# Altium schematic sheet B2B_connectors.SchDoc: AFE Mezzanine
size 420 x 297 mm; Author: K.B.; CompanyName: WUT; DrawnBy: K.B.; Organization: WUT ISE; Address1: Warsaw Univeristy of Technology; Address2: Nowowiejska 15/19; DocumentNumber: 8; Revision: -; SheetNumber: 8; SheetTotal: 8; EDA_Number: ARTIQ; Projet: ARTIQ/SINARA; ModifiedBy: -; CreateDate: XX/XX/XXXX; CheckedDate: -; Title2: Connectors; DivGrp: ISE; Designer: K.B.; ModifiedDate: -; ProjectName: ARTIQ/SINARA
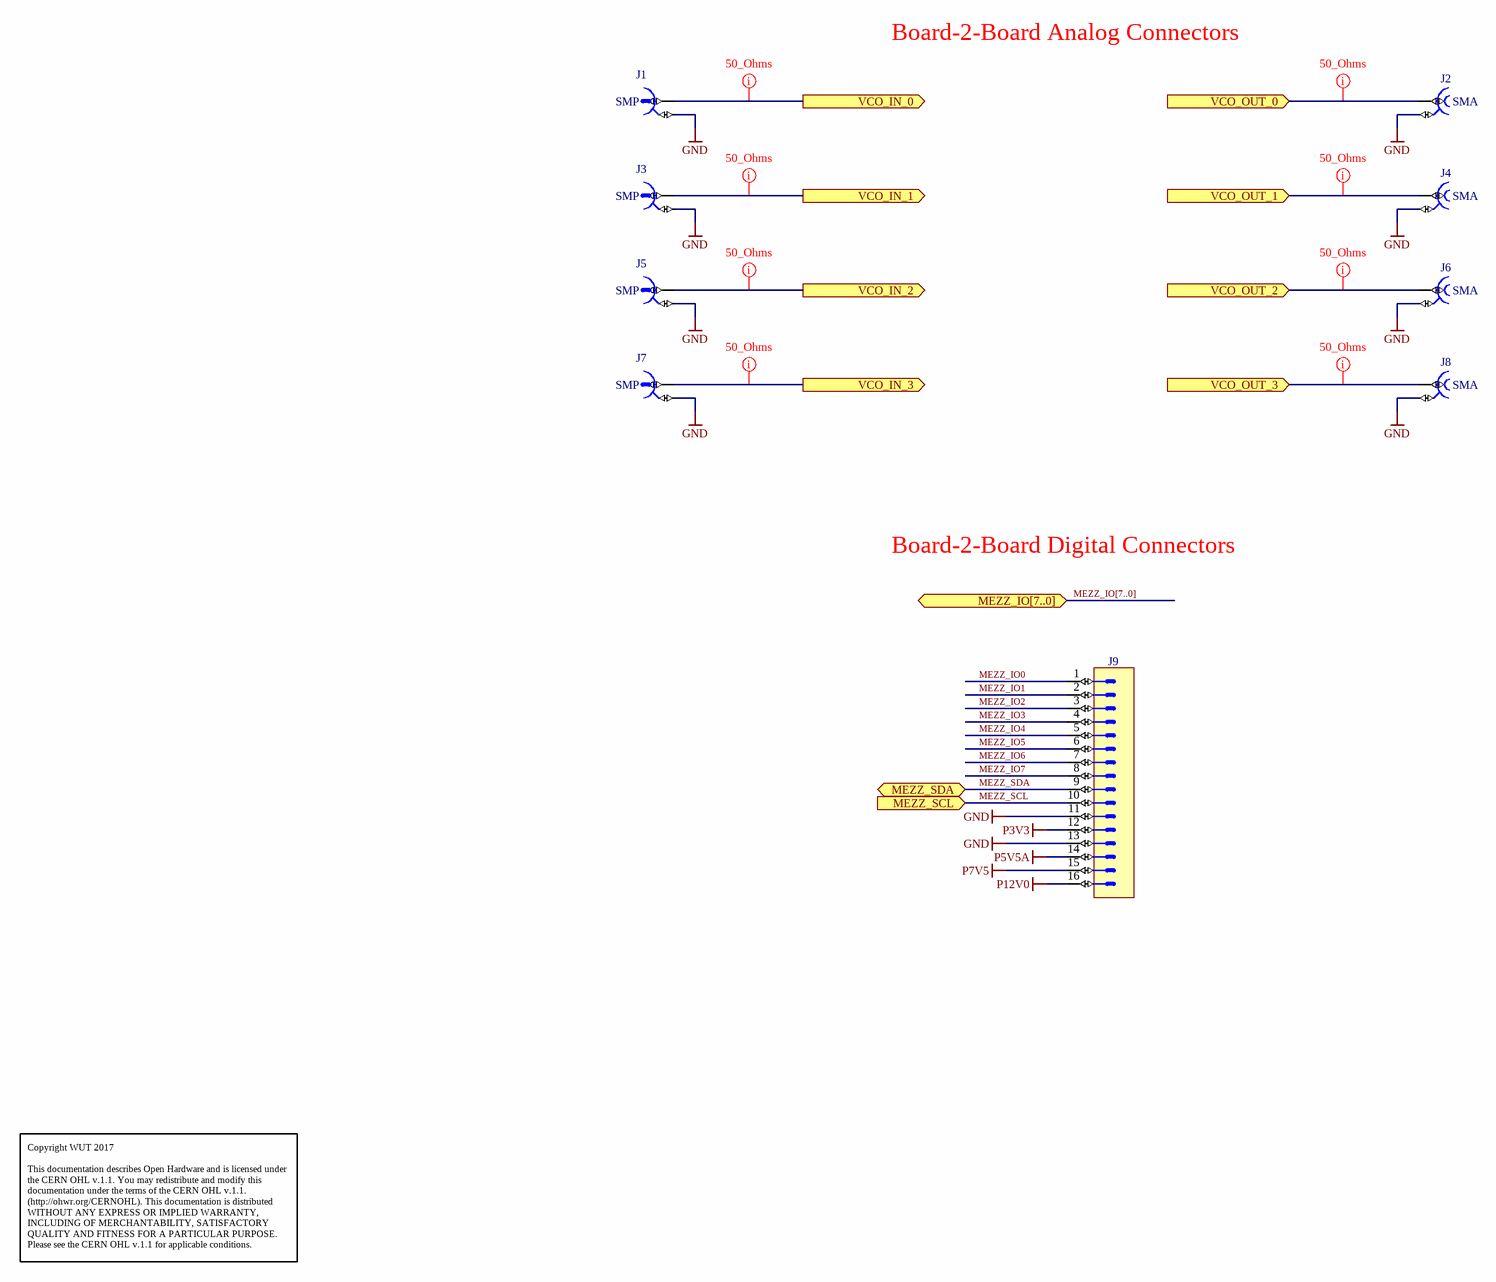
[diagram p0: B2B_connectors.SchDoc]

## Parts
J1  SMP  [MOLEX_85305-0232]
J2  SMA  [TELEGARTNER_J01151A0451]
J3  SMP  [MOLEX_85305-0232]
J4  SMA  [TELEGARTNER_J01151A0451]
J5  SMP  [MOLEX_85305-0232]
J6  SMA  [TELEGARTNER_J01151A0451]
J7  SMP  [MOLEX_85305-0232]
J8  SMA  [TELEGARTNER_J01151A0451]
J9  Header 16  [3M_N2516-6002RB]  (value not drawn)

## Ports
MEZZ_IO[7..0] (bidir), MEZZ_SCL (in), MEZZ_SDA (bidir), VCO_IN_0 (out), VCO_IN_1 (out), VCO_IN_2 (out), VCO_IN_3 (out), VCO_OUT_0 (in), VCO_OUT_1 (in), VCO_OUT_2 (in), VCO_OUT_3 (in)

## Nets
GND: J1.2 J2.2 J3.2 J4.2 J5.2 J6.2 J7.2 J8.2 J9.11 J9.13
P3V3: J9.12
P5V5A: J9.14
P7V5: J9.15
P12V0: J9.16
MEZZ_IO0: J9.1
MEZZ_IO1: J9.2
MEZZ_IO2: J9.3
MEZZ_IO3: J9.4
MEZZ_IO4: J9.5
MEZZ_IO5: J9.6
MEZZ_IO6: J9.7
MEZZ_IO7: J9.8
MEZZ_SCL: J9.10 ; port MEZZ_SCL
MEZZ_SDA: J9.9 ; port MEZZ_SDA
VCO_IN_0: J1.1 ; port VCO_IN_0
VCO_IN_1: J3.1 ; port VCO_IN_1
VCO_IN_2: J5.1 ; port VCO_IN_2
VCO_IN_3: J7.1 ; port VCO_IN_3
VCO_OUT_0: J2.1 ; port VCO_OUT_0
VCO_OUT_1: J4.1 ; port VCO_OUT_1
VCO_OUT_2: J6.1 ; port VCO_OUT_2
VCO_OUT_3: J8.1 ; port VCO_OUT_3

## Buses and harness runs
bus MEZZ_IO[7..0] = port MEZZ_IO[7..0]

## Layout directives
net class 50_Ohms: VCO_IN_0, VCO_IN_1, VCO_IN_2, VCO_IN_3, VCO_OUT_0, VCO_OUT_1, VCO_OUT_2, VCO_OUT_3

## Notes on the sheet
- Board-2-Board Analog Connectors
- Board-2-Board Digital Connectors
- Copyright WUT 2017
  This documentation describes Open Hardware and is licensed under the CERN OHL v.1.1. You may redistribute and modify this documentation under the terms of the CERN OHL v.1.1. (http://ohwr.org/CERNOHL). This documentation is distributed WITHOUT ANY EXPRESS OR IMPLIED WARRANTY, INCLUDING OF MERCHANTABILITY, SATISFACTORY QUALITY AND FITNESS FOR A PARTICULAR PURPOSE. Please see the CERN OHL v.1.1 for applicable conditions.
- Project/Equipment
- Document
- Designer
- Drawn by
- Check.by
- File
- Last Mod.
- Print Date
- Sheet
- Size
- A3
- of
- Rev

## Library data of the parts
J1 J3 J5 J7 = MOLEX_85305-0232: Part Description: 50 Ohms, SMP Surface Mount Plug, Limited Detent; Manufacturer: MOLEX; PressFit: No; Part Number: MOLEX_85305-0232; Component Kind: Standard; Component Type: Standard; Pin Count: 2; Family: SMP; Mounted: Yes; Socket: No; SMD: Yes; Sense: No; Status: None; Manufacturer Part Number: 85305-0232; ComponentHeight: 4.1mm; HelpURL: \\cern.ch\dfs\Applications\Altium\Datasheets\MOLEX_85305-0232.pdf; Author: CERN DEM JMW; CreateDate: 09.08.2016; LatestRevisionDate: 09.08.2016
J2 J4 J6 J8 = TELEGARTNER_J01151A0451: Part Description: SMA 50 ohms Edge Mount Bulkhead Jack Receptacle; PressFit: No; Part Number: TELEGARTNER_J01151A0451; Component Kind: Standard; Component Type: Standard; Pin Count: 2; Family: SMA; Mounted: Yes; Socket: No; SMD: No; Sense: No; Status: None; Manufacturer: TELEGARTNER; Manufacturer Part Number: J01151A0451; ComponentHeight: 7mm; HelpURL: \\cern.ch\dfs\Applications\Altium\Datasheets\TELEGARTNER_J01151A0451.pdf; Author: CERN DEM JLC; CreateDate: 27.10.2016; LatestRevisionDate: 27.10.2016
J9 = 3M_N2516-6002RB: Connector 16 Male; Part Description: 16 Contacts - Straight .100'' x .100'' Low Profile Four-Wall Header, 2500 Series; Manufacturer: 3M; PressFit: No; Part Number: 3M_N2516-6002RB; Component Kind: Standard; Component Type: Standard; Pin Count: 16; Family: Header 16; Mounted: Yes; Socket: No; SMD: No; Sense: No; Status: None; Manufacturer Part Number: N2516-6002RB; ComponentHeight: 10.03mm; HelpURL: \\cern.ch\dfs\Applications\Altium\Datasheets\3M_N2516-6002RB.pdf; Author: CERN DEM JLC; CreateDate: 11.02.2009; LatestRevisionDate: 11.08.2009